# Altium schematic sheet Reset_With_Power_On.SchDoc: Reset_With_Power_On
size A4
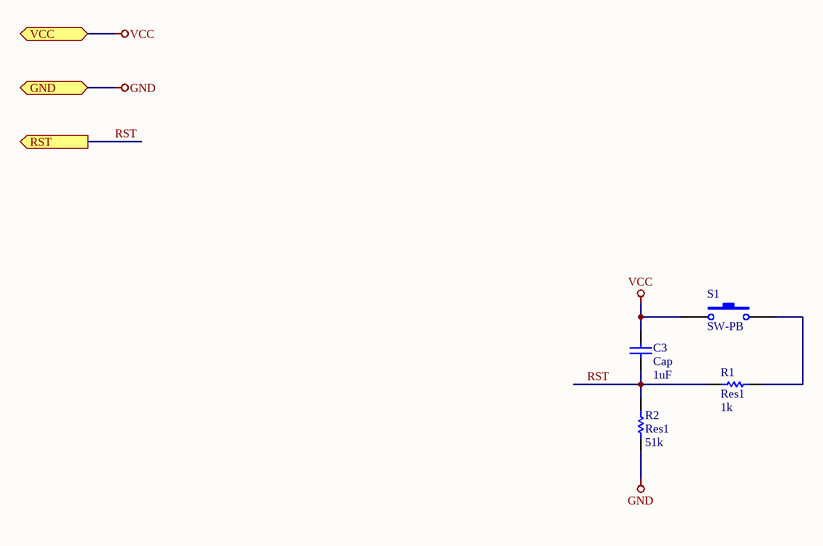
[diagram p0: Reset_With_Power_On.SchDoc]

## Parts
C3  Cap  value 1uF  [C0805]
R1  Res1  value 1k  [R0805]
R2  Res1  value 51k  [R0805]
S1  SW-PB  [KEY-DIP4]

## Ports
GND, RST (out), VCC

## Nets
GND: R2.1 ; port GND
VCC: C3.1 S1.1 ; port VCC
RST: C3.2 R1.1 R2.2 ; port RST
NetR1_2: R1.2 S1.2

## Library data of the parts
C3 = Cap: Non-Polar Capacitor
R1 R2 = Res1: Resistor
S1 = SW-PB: Switch